# EAGLE design HIC_Board (EAGLE 7.5.0)
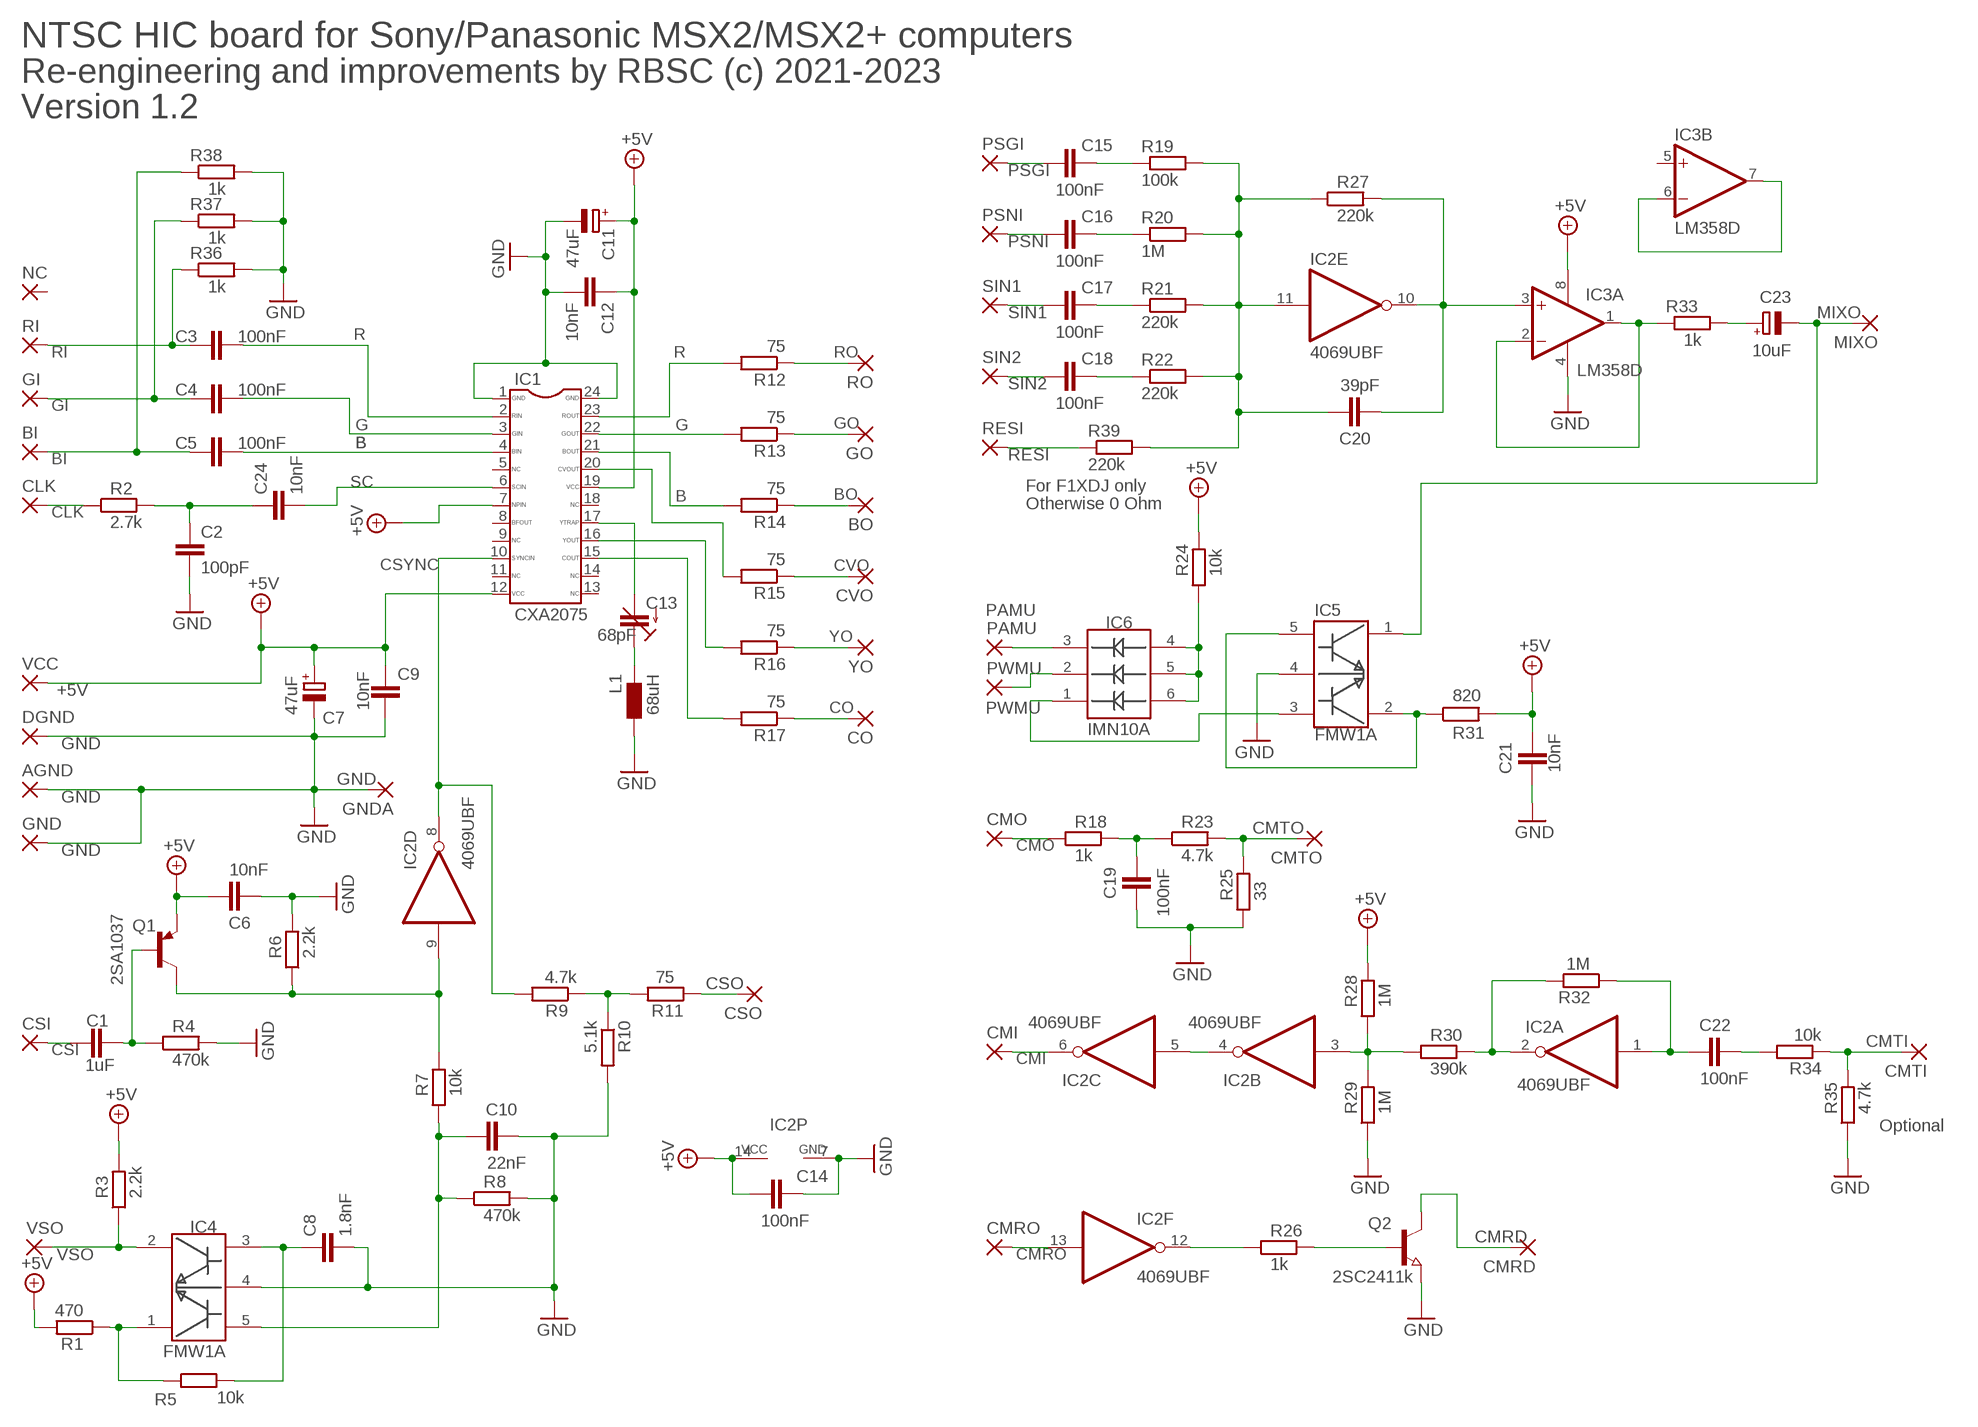
[diagram p0: schematic, sheet 1]

## Parts
AGND  HICPADSMD  [SMD1,27-2,54]
BI  HICPADSMD  [SMD1,27-2,54]
BO  HICPADSMD  [SMD1,27-2,54]
C1  1uF  C-EUC1210  [C1210]
C2  100pF  C-EUC0805  [C0805]
C3  100nF  C-EUC0805  [C0805]
C4  100nF  C-EUC0805  [C0805]
C5  100nF  C-EUC0805  [C0805]
C6  10nF  C-EUC0805  [C0805]
C7  47uF  CPOL-EUSMCB  [SMC_B]
C8  1.8nF  C-EUC0805  [C0805]
C9  10nF  C-EUC0805  [C0805]
C10  22nF  C-EUC0805  [C0805]
C11  47uF  CPOL-EUSMCB  [SMC_B]
C12  10nF  C-EUC0805  [C0805]
C13  68pF  C-TRIMMTZ03  [CTRIMTZ03]
C14  100nF  C-EUC0805  [C0805]
C15  100nF  C-EUC0805  [C0805]
C16  100nF  C-EUC0805  [C0805]
C17  100nF  C-EUC0805  [C0805]
C18  100nF  C-EUC0805  [C0805]
C19  100nF  C-EUC0805  [C0805]
C20  39pF  C-EUC0805  [C0805]
C21  10nF  C-EUC0805  [C0805]
C22  100nF  C-EUC0805  [C0805]
C23  10uF  CPOL-EUSMCB  [SMC_B]
C24  10nF  C-EUC0805  [C0805]
CLK  HICPADSMD  [SMD1,27-2,54]
CMI  HICPADSMD  [SMD1,27-2,54]
CMO  HICPADSMD  [SMD1,27-2,54]
CMRD  HICPADSMD  [SMD1,27-2,54]
CMRO  HICPADSMD  [SMD1,27-2,54]
CMTI  HICPADSMD  [SMD1,27-2,54]
CMTO  HICPADSMD  [SMD1,27-2,54]
CO  HICPADSMD  [SMD1,27-2,54]
CSI  HICPADSMD  [SMD1,27-2,54]
CSO  HICPADSMD  [SMD1,27-2,54]
CVO  HICPADSMD  [SMD1,27-2,54]
DGND  HICPADSMD  [SMD1,27-2,54]
GI  HICPADSMD  [SMD1,27-2,54]
GND  HICPADSMD  [SMD1,27-2,54]
GNDA  HICPADSMD  [SMD1,27-2,54]
GO  HICPADSMD  [SMD1,27-2,54]
IC1  CXA2075  [SOP24]
IC2  4069UBF  74HCT04D  [SO14]
IC3  LM358D  [SO08]
IC4  FMW1A  [SMT5]
IC5  FMW1A  [SMT5]
IC6  IMN10A  [SMT6]
L1  68uH  LL3225M  [L3225M]
MIXO  HICPADSMD  [SMD1,27-2,54]
NC  HICPADSMD  [SMD1,27-2,54]
PAMU  HICPADSMD  [SMD1,27-2,54]
PSGI  HICPADSMD  [SMD1,27-2,54]
PSNI  HICPADSMD  [SMD1,27-2,54]
PWMU  HICPADSMD  [SMD1,27-2,54]
Q1  2SA1037  BCX71SMD  [SOT23]
Q2  2SC2411k  NPN-TRANSISTOR_SOT23  [SOT23]
R1  470  R-EU_R0805  [R0805]
R2  2.7k  R-EU_R0805  [R0805]
R3  2.2k  R-EU_R0805  [R0805]
R4  470k  R-EU_R0805  [R0805]
R5  10k  R-EU_R0805  [R0805]
R6  2.2k  R-EU_R0805  [R0805]
R7  10k  R-EU_R0805  [R0805]
R8  470k  R-EU_R0805  [R0805]
R9  4.7k  R-EU_R0805  [R0805]
R10  5.1k  R-EU_R0805  [R0805]
R11  75  R-EU_R0805  [R0805]
R12  75  R-EU_R0805  [R0805]
R13  75  R-EU_R0805  [R0805]
R14  75  R-EU_R0805  [R0805]
R15  75  R-EU_R0805  [R0805]
R16  75  R-EU_R0805  [R0805]
R17  75  R-EU_R0805  [R0805]
R18  1k  R-EU_R0805  [R0805]
R19  100k  R-EU_R0805  [R0805]
R20  1M  R-EU_R0805  [R0805]
R21  220k  R-EU_R0805  [R0805]
R22  220k  R-EU_R0805  [R0805]
R23  4.7k  R-EU_R0805  [R0805]
R24  10k  R-EU_R0805  [R0805]
R25  33  R-EU_R0805  [R0805]
R26  1k  R-EU_R0805  [R0805]
R27  220k  R-EU_R0805  [R0805]
R28  1M  R-EU_R0805  [R0805]
R29  1M  R-EU_R0805  [R0805]
R30  390k  R-EU_R0805  [R0805]
R31  820  R-EU_R0805  [R0805]
R32  1M  R-EU_R0805  [R0805]
R33  1k  R-EU_R0805  [R0805]
R34  10k  R-EU_R0805  [R0805]
R35  4.7k  R-EU_R0805  [R0805]
R36  1k  R-EU_R0805  [R0805]
R37  1k  R-EU_R0805  [R0805]
R38  1k  R-EU_R0805  [R0805]
R39  220k  R-EU_R0805  [R0805]
RESI  HICPADSMD  [SMD1,27-2,54]
RI  HICPADSMD  [SMD1,27-2,54]
RO  HICPADSMD  [SMD1,27-2,54]
SIN1  HICPADSMD  [SMD1,27-2,54]
SIN2  HICPADSMD  [SMD1,27-2,54]
VCC  HICPADSMD  [SMD1,27-2,54]
VSO  HICPADSMD  [SMD1,27-2,54]
YO  HICPADSMD  [SMD1,27-2,54]

## Nets
+5V: C6.1 C7.+ C9.2 C11.+ C12.1 C14.2 C21.2 IC1.7 IC1.12 IC1.19 IC2.14(P:VCC) IC3.8(P:V+) Q1.2(E) R1.2 R3.2 R24.2 R28.2 R31.2 VCC.1(P)
CMRD: CMRD.1(P) Q2.3(C)
CMTI: CMTI.1(P) R34.1 R35.2
CMTO: CMTO.1(P) R23.2 R25.2
CSO: CSO.1(P) R11.1
GND: AGND.1(P) C2.1 C6.2 C7.- C8.1 C9.1 C10.2 C11.- C12.2 C14.1 C19.2 C21.1 DGND.1(P) GND.1(P) GNDA.1(P) IC1.1 IC1.24 IC2.7(P:GND) IC3.4(P:V-) IC4.4 IC5.4 L1.1 Q2.2(E) R4.2 R6.2 R8.2 R10.2 R25.1 R29.1 R35.1 R36.2 R37.2 R38.2
MIXO: C23.- IC5.1 MIXO.1(P)
N$1: IC1.23 R12.2
N$2: IC1.22 R13.2
N$3: IC1.21 R14.2
N$4: R12.1 RO.1(P)
N$5: GO.1(P) R13.1
N$6: C3.1 R36.1 RI.1(P)
N$7: C4.1 GI.1(P) R37.1
N$8: BO.1(P) R14.1
N$9: R16.1 YO.1(P)
N$10: CVO.1(P) R15.1
N$11: C2.2 C24.2 R2.2
N$12: R39.1 RESI.1(P)
N$13: C1.2 CSI.1(P)
N$14: CLK.1(P) R2.1
N$15: C13.1(E) L1.2
N$16: IC1.16 R16.2
N$17: CMO.1(P) R18.1
N$19: CMI.1(P) IC2.6(C:O)
N$21: C19.1 R18.2 R23.1
N$22: IC2.4(B:O) IC2.5(C:I)
N$24: C13.2(A) IC1.17
N$25: IC2.3(B:I) R28.1 R29.2 R30.1
N$26: CMRO.1(P) IC2.13(F:I)
N$27: IC2.2(A:O) R30.2 R32.2
N$28: C22.1 IC2.1(A:I) R32.1
N$29: C22.2 R34.2
N$31: IC2.12(F:O) R26.1
N$32: Q2.1(B) R26.2
N$38: C17.2 R21.1
N$39: C15.2 R19.1
N$40: C16.2 R20.1
N$41: C18.2 R22.1
N$43: C20.2 IC2.10(E:O) IC3.3(A:+IN) R27.2
N$44: C23.+ R33.2
N$46: IC3.6(B:-IN) IC3.7(B:OUT)
N$47: IC5.2 IC5.5 R31.1
N$48: IC5.3 IC6.1
N$49: IC6.4 IC6.5 IC6.6 R24.1
N$51: C1.1 Q1.1(B) R4.1
N$52: IC3.1(A:OUT) IC3.2(A:-IN) R33.1
N$53: IC2.9(D:I) Q1.3(C) R6.1 R7.2
N$54: C8.2 IC4.3 R5.2
N$55: BI.1(P) C5.1 R38.1
N$56: C4.2 IC1.3
N$57: C3.2 IC1.2
N$58: C5.2 IC1.4
N$59: IC1.10 IC2.8(D:O) R9.2
N$60: IC4.1 R1.1 R5.1
N$61: R9.1 R10.1 R11.2
N$62: C10.1 IC4.5 R7.1 R8.1
N$63: C24.1 IC1.6
N$64: IC1.20 R15.2
N$65: CO.1(P) R17.1
N$68: IC1.15 R17.2
PAMU: IC6.3 PAMU.1(P)
PSGI: C15.1 PSGI.1(P)
PSNI: C16.1 PSNI.1(P)
PWMU: IC6.2 PWMU.1(P)
RESI: C20.1 IC2.11(E:I) R19.2 R20.2 R21.2 R22.2 R27.1 R39.2
SIN1: C17.1 SIN1.1(P)
SIN2: C18.1 SIN2.1(P)
VSO: IC4.2 R3.1 VSO.1(P)
Unconnected: IC1.5 IC1.8 IC1.9 IC1.11 IC1.13 IC1.14 IC1.18 IC3.5(B:+IN) NC.1(P)

## Notes on the sheet
- NTSC HIC board for Sony/Panasonic MSX2/MSX2+ computers
- Re-engineering and improvements by RBSC (c) 2021-2023
- Version 1.2
- R
- RI | R | RO
- GI
- G | G | GO
- B | B
- BI
- SC | For F1XDJ only
- B | BO
- Otherwise 0 Ohm
- CLK
- CSYNC
- CVO
- YO
- CO
- CMO
- CSI
- CMI
- Optional
- CMRO

## Library data of the parts
AGND BI BO CLK CMI CMO CMRD CMRO CMTI CMTO CO CSI CSO CVO DGND GI GND GNDA GO MIXO NC PAMU PSGI PSNI PWMU RESI RI RO SIN1 SIN2 VCC VSO YO = combopad:HICPADSMD: SMD PAD
C1-C6 C8-C10 C12 C14-C22 C24 = rcl:C-EU: CAPACITOR, European symbol; OC_FARNELL: unknown
C7 C11 C23 = rcl:CPOL-EU: POLARIZED CAPACITOR, European symbol; OC_FARNELL: unknown
C13 = rcl:C-TRIMM: Trimm capacitor
IC1 = CXA2075M:CXA2075; OC_FARNELL: unknown
IC2 = 74xx-eu:74*04: Hex INVERTER
IC3 = linear:LM358: OP AMP also LM158; LM258; LM2904 Source: http://cache.national.com/ds/LM/LM158.pdf
IC4 IC5 = fmw1:FMW1: FMW1
IC6 = imn10:IMN10: IMN10
L1 = eagle-ltspice:L: INDUCTOR, European symbol; SPICEMODEL: NONE; SPICEPREFIX: L
Q1 = transistor-pnp:BCX71SMD: PNP Transistor
Q2 = semicon-smd-ipc:NPN-TRANSISTOR_: NPN TRANSISTOR
R1-R39 = rcl:R-EU_: RESISTOR, European symbol; OC_FARNELL: unknown

## Board
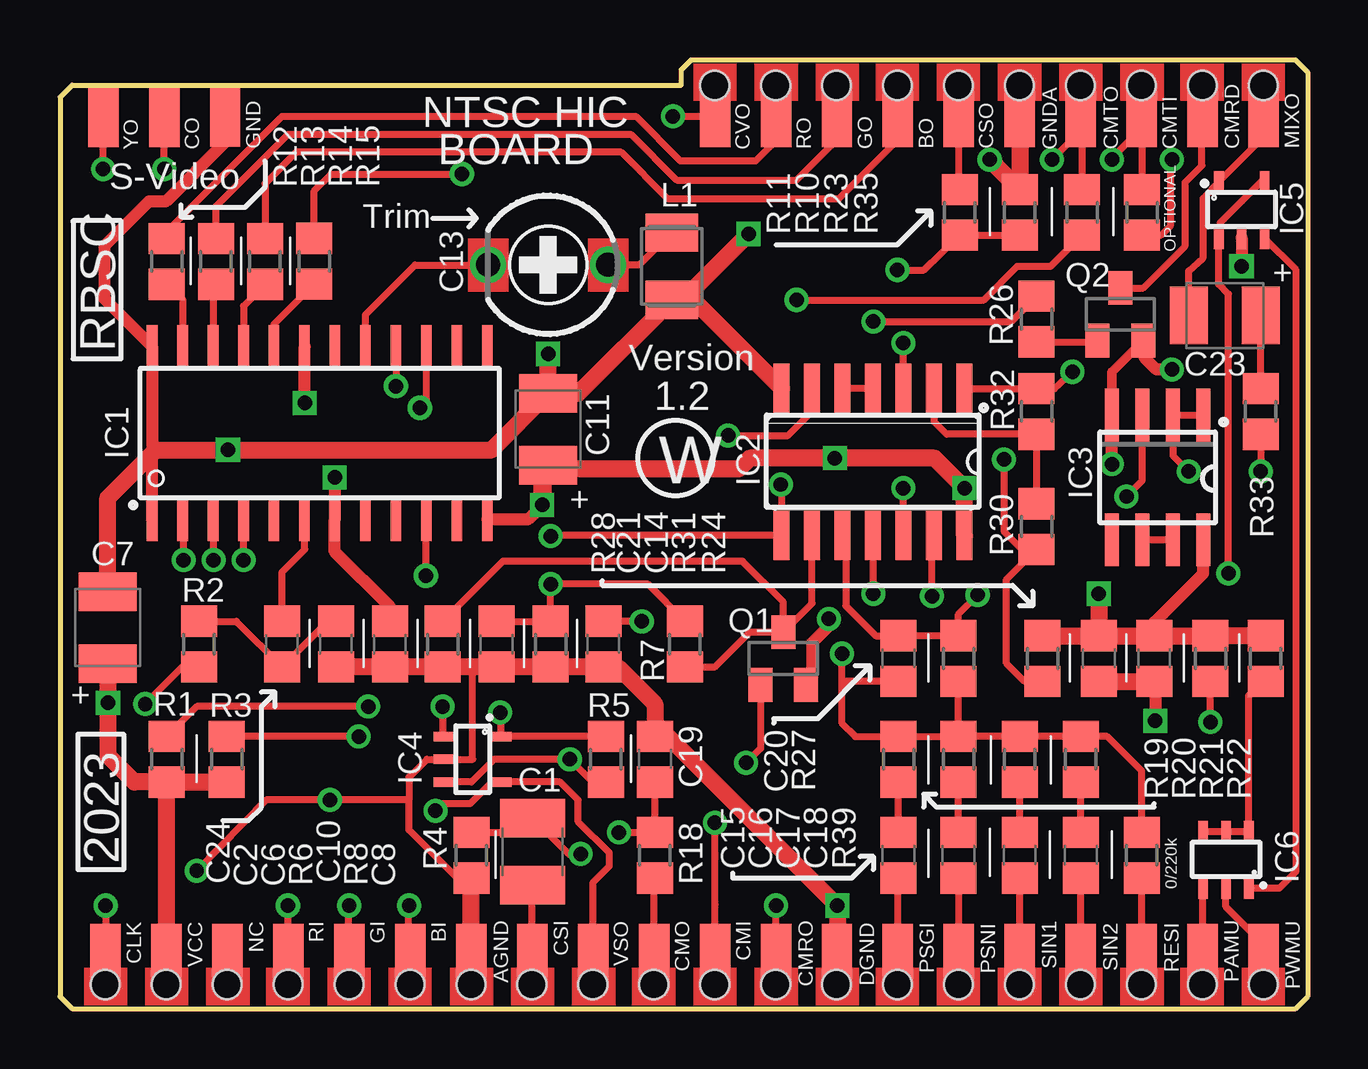
[diagram p1: board, top side]
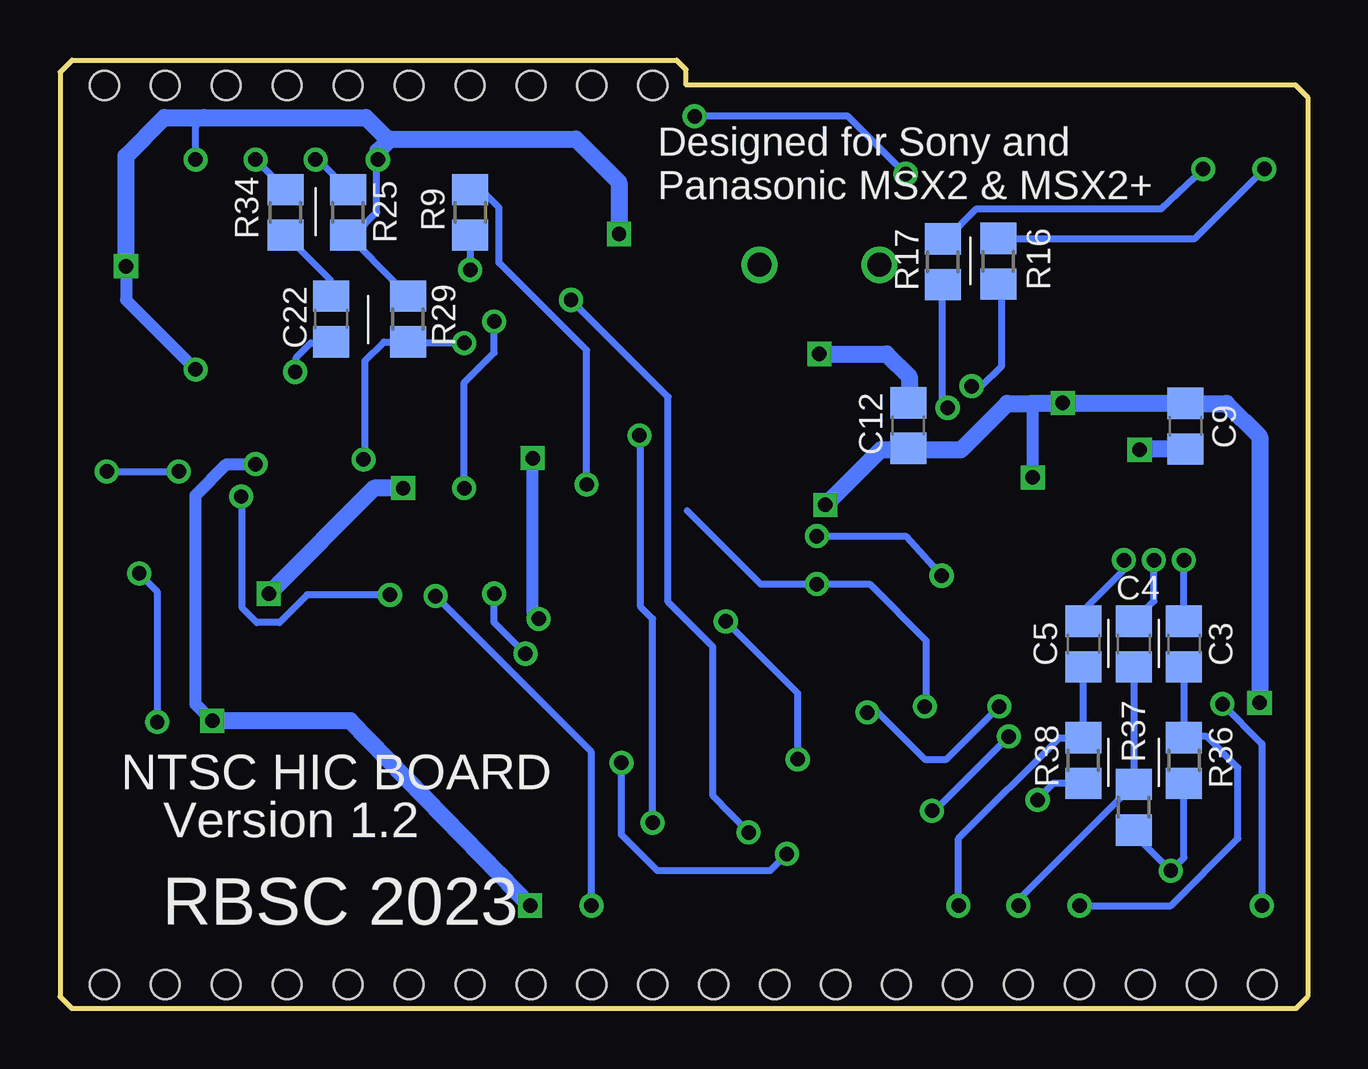
[diagram p2: board, bottom side, seen from below]

Size 52 x 39.55 mm. Coordinates in mm from the lower left corner, seen from the top.
Outline: 0,38 0,0.5 0.5,0 51.5,0 52,0.5 52,39.05 51.5,39.55 26.3,39.55 25.9,39.15 25.9,38.5 0.5,38.5 0,38
Copper layers (1*16): Top 0.035mm / dielectric 1.5mm / Bottom 0.035mm
Design rules "default *": minimum track width 10mil, minimum drill 24mil, track to track 8mil, track to pad 8mil, pad to pad 8mil, via to via 8mil, smd to smd 8mil, copper to edge 4mil, drill to drill 8mil, minimum pad ring 10mil, minimum via ring 8mil, stop-mask expansion 4mil, vias tented up to drill 24mil, thermal gap 10mil
Holes 1.2 mm at 27.29,38.49 29.83,38.49 32.37,38.49 34.91,38.49 37.45,38.49 39.99,38.49 42.53,38.49 45.07,38.49 47.61,38.49 50.15,38.49 1.89,1.01 4.43,1.01 6.97,1.01 9.51,1.01 12.05,1.01 14.59,1.01 17.13,1.01 19.67,1.01 22.21,1.01 24.75,1.01 27.29,1.01 29.83,1.01 32.37,1.01 34.91,1.01 37.45,1.01 39.99,1.01 42.53,1.01 45.07,1.01 47.61,1.01 50.15,1.01

### Footprints (pad centres in the part's own frame; a part is rotated, then mirrored left to right if it is on the bottom)
SMD1,27-2,54 = smd 1.27 x 2.54: 1 0,0
C1210 = smd 1.6 x 2.7: 1 -1.4,0; 2 1.4,0
C0805 = smd 1.3 x 1.5: 1 -0.95,0; 2 0.95,0
SMC_B = smd 1.6 x 2.4: + -1.5,0; - 1.5,0
CTRIMTZ03 = drill 1: 1 0,2.5; 2 0,-2.5
SOP24 = smd 0.45 x 1.8: 1 -6.97,-3.6; 2 -5.7,-3.6; 3 -4.43,-3.6; 4 -3.16,-3.6; 5 -1.89,-3.6; 6 -0.62,-3.6; 7 0.65,-3.6; 8 1.92,-3.6; 9 3.19,-3.6; 10 4.46,-3.6; 11 5.73,-3.6; 12 7,-3.6; 13 7,3.6; 14 5.73,3.6; 15 4.46,3.6; 16 3.19,3.6; 17 1.92,3.6; 18 0.65,3.6; 19 -0.62,3.6; 20 -1.89,3.6; 21 -3.16,3.6; 22 -4.43,3.6; 23 -5.7,3.6; 24 -6.97,3.6
SO14 = smd 0.66 x 2.032: 1 -3.81,-3.073; 2 -2.54,-3.073; 3 -1.27,-3.073; 4 0,-3.073; 5 1.27,-3.073; 6 2.54,-3.073; 7 3.81,-3.073; 8 3.81,3.073; 9 2.54,3.073; 10 1.27,3.073; 11 0,3.073; 12 -1.27,3.073; 13 -2.54,3.073; 14 -3.81,3.073
SO08 = smd 0.6 x 2.2: 1 -1.905,-2.6; 2 -0.635,-2.6; 3 0.635,-2.6; 4 1.905,-2.6; 5 1.905,2.6; 6 0.635,2.6; 7 -0.635,2.6; 8 -1.905,2.6
SMT5 = smd 0.9 x 0.4: 1 1.175,0.95; 2 1.175,-0.95; 3 -1.175,-0.95; 4 -1.175,0; 5 -1.175,0.95
SMT6 = smd 0.9 x 0.4: 1 1.175,0.95; 2 1.175,0; 3 1.175,-0.95; 4 -1.175,-0.95; 5 -1.175,0; 6 -1.175,0.95
L3225M = smd 1.6 x 2.2: 1 -1.4,0; 2 1.4,0
SOT23 = smd 1 x 1.4: 1 -0.95,-1.1; 2 0.95,-1.1; 3 0,1.1
R0805 = smd 1.3 x 1.5: 1 -0.95,0; 2 0.95,0

### Placement (x,y rotation side)
AGND  17.14,2.27 0 top
BI  14.61,2.27 0 top
BO  34.92,37.2 180 top
C1  19.7,6.55 270 top
C2  11.5,15.2 90 top
C3  5.15,15.2 90 bottom
C4  7.24,15.2 90 bottom
C5  9.34,15.2 90 bottom
C6  13.75,15.2 270 top
C7  1.99,15.89 90 top
C8  22.65,15.2 90 top
C9  5.09,24.29 90 bottom
C10  18.2,15.2 270 top
C11  20.34,24.16 90 top
C12  16.64,24.31 90 bottom
C13  20.34,31.01 270 top
C14  45.61,14.6 90 top
C15  34.95,6.4 90 top
C16  37.45,6.4 90 top
C17  40,6.4 90 top
C18  42.55,6.4 90 top
C19  24.8,10.4 90 top
C20  34.95,14.6 90 top
C21  43.3,14.6 90 top
C22  40.7,28.75 90 bottom
C23  48.55,28.9 180 top
C24  9.25,15.2 270 top
CLK  1.9,2.27 0 top
CMI  27.3,2.27 0 top
CMO  24.76,2.27 0 top
CMRD  47.62,37.2 180 top
CMRO  29.84,2.27 0 top
CMTI  45.09,37.2 180 top
CMTO  42.55,37.2 180 top
CO  4.35,37.2 180 top
CSI  19.68,2.27 0 top
CSO  37.46,37.2 180 top
CVO  27.3,37.2 180 top
DGND  32.38,2.27 0 top
GI  12.06,2.27 0 top
GND  6.89,37.2 0 top
GNDA  40,37.2 180 top
GO  32.38,37.2 180 top
IC1  10.81,24 0 top
IC2  33.89,22.79 180 top
IC3  45.75,22.15 180 top
IC4  17.2,10.4 0 top
IC5  49.25,33.3 90 top
IC6  48.6,6.2 270 top
L1  25.5,30.95 90 top
MIXO  50.16,37.2 180 top
NC  6.99,2.27 0 top
PAMU  47.62,2.27 0 top
PSGI  34.92,2.27 0 top
PSNI  37.46,2.27 0 top
PWMU  50.16,2.27 0 top
Q1  30.15,14.6 0 top
Q2  44.2,28.95 0 top
R1  4.45,10.4 270 top
R2  5.8,15.2 90 top
R3  6.95,10.4 270 top
R4  17.15,6.4 270 top
R5  22.75,10.4 270 top
R6  15.95,15.2 270 top
R7  26.05,15.2 270 top
R8  20.45,15.2 270 top
R9  34.9,33.2 90 bottom
R10  40,33.2 90 top
R11  37.5,33.2 270 top
R12  4.45,31.15 270 top
R13  6.5,31.15 270 top
R14  8.55,31.15 270 top
R15  10.6,31.16 270 top
R16  12.89,31.16 270 bottom
R17  15.21,31.14 270 bottom
R18  24.8,6.4 90 top
R19  34.95,10.4 90 top
R20  37.45,10.4 90 top
R21  40,10.4 90 top
R22  42.55,10.4 90 top
R23  42.6,33.2 90 top
R24  50.25,14.6 90 top
R25  40,33.2 90 bottom
R26  40.7,28.75 270 top
R27  37.45,14.6 90 top
R28  40.95,14.6 90 top
R29  37.5,28.75 270 bottom
R30  40.7,20.1 90 top
R31  47.95,14.6 90 top
R32  40.7,24.9 270 top
R33  50.05,24.9 90 top
R34  42.6,33.2 270 bottom
R35  45.1,33.2 90 top
R36  5.15,10.35 270 bottom
R37  7.25,8.4 270 bottom
R38  9.35,10.35 270 bottom
R39  45.09,6.4 90 top
RESI  45.09,2.27 0 top
RI  9.53,2.27 0 top
RO  29.84,37.2 180 top
SIN1  40,2.27 0 top
SIN2  42.55,2.27 0 top
VCC  4.45,2.27 0 top
VSO  22.22,2.27 0 top
YO  1.8,37.2 180 top

### Tracks (layer width: path | path; a pad name or v marks a point on that pad's centre or on a via)
+5V  (via drill 0.6)
  Top 0.3: C14.2 45.61,16.11 | IC3.8 | C11.+ 20.34,21.24 v20.1,21 | IC1.12 | C6.1 13.75,16.75 | IC1.7
  Top 0.4: 10.2,27.59 IC1.19 | v11.46,22.14 v11.45,22.15
  Top 0.5: 45.61,16.11 47.65,18.15 IC3.8 | v20.1,21 19.5,20.4 IC1.12 | v10.2,25.25 10.2,27.59 | IC1.7 v11.46,22.14 | 13.75,16.75 11.45,19.05 IC1.7 | v32.05,16.25 32.05,15.95 31.35,15.25 31.35,13.75 Q1.2
  Top 0.7: v20.1,21 20.1,22.41 C11.+ 20.5,22.5 28.3,22.5 28.75,22.95 v32.3,22.95 36.45,22.95 v37.7,21.7 IC2.14 | VCC.1 R1.2 | R1.2 R3.2 | R1.2 3.1,9.45 2,10.55 v2,12.75 C7.+ | v43.3,17.3 C21.2 | C21.2 C14.2 R31.2 R24.2 | R28.2 C21.2
  Bottom 0.4: 10.21,25.23 v10.2,25.25
  Bottom 0.5: v11.45,22.15 11.45,25.18 | v32.05,16.25 32.3,16.5 v32.3,22.95
  Bottom 0.7: 11.5,25.23 10.21,25.23 C9.2 3.38,25.23 2,23.85 v2,12.75 | 16.58,23.3 14.45,23.3 12.52,25.23 11.5,25.23 | 16.58,23.3 C12.1 | 16.58,23.3 17.8,23.3 v20.1,21 | v37.7,21.7 38.9,21.7 v43.3,17.3 | 11.5,25.23 11.45,25.18
CMRD
  Top 0.3: Q2.3 45.15,30.05 46.9,31.8 46.9,34.45 47.6,35.15 47.6,37.17 CMRD.1
CMTI  (via drill 0.6)
  Top 0.3: CMTI.1 45.1,37.18 45.1,36.7 | 45.1,36.7 R35.2 | v43.85,35.4 43.85,35.45 45.1,36.7
  Bottom 0.3: R34.1 v43.85,35.4
CMTO  (via drill 0.6)
  Top 0.3: CMTO.1 42.6,37.14 42.6,36.65 | 42.6,36.65 R23.2 | v41.35,35.4 42.6,36.65
  Bottom 0.3: v41.35,35.4 41.2,35.35 R25.2
CSO
  Top 0.3: 37.5,37.16 CSO.1 37.46,34.18 R11.1
GND  (via drill 0.6)
  Top 0.3: R4.2 16.55,5.45 14.55,7.45 14.55,8.7 | 32.4,2.28 DGND.1 | 24.4,11 C19.2 | C11.- 20.79,25.66 | v20.34,27.29 v20.35,27.3 | 45.2,27.15 45.2,27.8 Q2.2 | 17.25,14.25 17.2,14.2 17.2,10.4 IC4.4 15.3,10.4 14.55,9.65 14.55,8.7 | C14.1 45.65,13.61 | v43.85,22.7 v43.84,22.7 | R10.2 39.95,34.16 | R35.1 45.9,32.25 46.3,32.65 46.3,35.3 v46.35,35.4 | 14.55,8.7 v11.25,8.7 8.6,8.7 v5.7,5.75
  Top 0.4: IC3.4 43.84,26.54 Q2.2 | 3.84,23.26 3.9,23.2 | 3.84,23.11 3.82,23.12
  Top 0.5: IC5.4 v49.25,30.95 | v46.35,26.65 45.7,26.65 45.2,27.15 | 3.84,23.26 IC1.24 1.85,29.59 1.85,31.8 3.7,33.65 4.4,33.65 6.89,36.13 GND.1 | IC1.1 3.84,23.11 | 45.65,13.61 v45.65,12 | v43.84,22.7 IC3.4
  Top 0.7: AGND.1 R4.2 | 32.4,2.28 v32.4,4.3 25.35,11.35 C19.2 24.8,12.7 23.3,14.2 22.7,14.2 C8.1 R8.2 C10.2 17.25,14.25 R6.2 C6.2 C2.1 | v20.34,27.29 C11.- 17.98,23.3 v7,23.3 4,23.3 3.9,23.2 3.82,23.12 1.99,21.29 C7.- | 20.79,25.66 21.61,25.66 L1.1 | L1.1 26.4,29.55 IC2.7 | C21.1 C14.1 | L1.1 25.95,29.55 v28.7,32.3 | GNDA.1 R10.2 | 39.95,34.16 v38.75,35.4
  Bottom 0.3: 16.6,25.3 C12.2 | R29.1 37.5,30.15 37.9,30.15 R25.1 39.75,32.25 38.8,33.2 38.8,35.35 v38.75,35.4 | v46.35,35.4 46.35,36.8 46,37.15 | 6.97,23.33 v7,23.3 | R38.2 10.6,9.4 11.25,8.75 v11.25,8.7 | R37.2 7.25,7.3 v5.7,5.75 5.15,6.3 R36.2 | 33.6,5.64 33.65,5.59
  Bottom 0.5: v49.25,30.95 49.25,29.55 v46.35,26.65 | v45.65,12 46.35,12.7 46.35,21.4 45.05,22.7 v43.85,22.7
  Bottom 0.7: v20.35,27.3 17.55,27.3 16.6,26.35 16.6,25.3 | v32.4,4.3 33.65,5.59 39.9,12 v45.65,12 | 38.3,36.2 38.25,36.25 30.5,36.25 28.7,34.45 v28.7,32.3 28.75,32.3 | v49.25,30.95 49.25,35.55 47.65,37.15 46,37.15 39.25,37.15 38.3,36.2 | v38.75,35.4 38.75,35.75 38.3,36.2 | C9.1 6.97,23.33
MIXO
  Top 0.3: MIXO.1 50.16,36.34 IC5.1 47.65,33.77 47.65,31.3 47.05,30.75 C23.-
N$1
  Top 0.3: R12.2 5.11,29.59 IC1.23
N$2
  Top 0.3: R13.2 6.38,30.08 IC1.22
N$3
  Top 0.3: R14.2 7.65,29.3 IC1.21
N$4
  Top 0.3: R12.1 4.5,32.45 9.25,37.2 24,37.2 25.85,35.35 29,35.35 30.05,36.4 30.05,36.99 RO.1
N$5
  Top 0.3: R13.1 6.5,33.45 9.5,36.45 23.8,36.45 25.7,34.55 30.7,34.55 32.4,36.25 32.4,37.18 GO.1
N$6  (via drill 0.6)
  Top 0.3: RI.1 9.5,2.29 v9.5,4.3
  Bottom 0.3: C3.1 R36.1 5.1,11.35 4.2,11.35 2.9,10.05 2.9,7.1 5.7,4.3 v9.5,4.3
N$7  (via drill 0.6)
  Top 0.3: GI.1 12.04,2.29 v12.04,4.29 v12.05,4.3
  Bottom 0.3: C4.1 R37.1 12.05,4.55 v12.05,4.3
N$8
  Top 0.3: 34.92,37.12 BO.1 34.95,37.17 34.95,36.25 32.45,33.75 25.35,33.75 23.4,35.7 9.85,35.7 8.55,34.4 R14.1
N$9  (via drill 0.6)
  Top 0.3: v1.8,35 YO.1
  Bottom 0.3: R16.1 4.69,32.11 v1.8,35
N$10  (via drill 0.6)
  Top 0.3: R15.1 10.6,34.09 11.3,34.8 v16.75,34.8 | v25.55,37.2 CVO.1
  Bottom 0.3: v16.75,34.8 19.15,37.2 v25.55,37.2
N$11
  Top 0.3: R2.2 7.35,16.15 C24.2 11.15,16.15 C2.2
N$12
  Top 0.3: RESI.1 R39.1
N$13
  Top 0.3: CSI.1 19.68,5.14 C1.2
N$14  (via drill 0.6)
  Top 0.3: 2,2.36 CLK.1 v1.9,4.3 | R2.1 5.1,14.25 v3.55,12.7
  Bottom 0.3: v3.55,12.7 1.9,11.05 v1.9,4.3
N$15
  Top 0.3: C13.1 24.16,31.01 L1.2
N$16  (via drill 0.6)
  Top 0.3: IC1.16 v14,25.95
  Bottom 0.3: v14,25.95 13.6,25.95 12.75,26.8 12.75,30.06 R16.2
N$17
  Top 0.3: CMO.1 24.76,5.42 R18.1
N$19  (via drill 0.6)
  Top 0.3: v27.85,23.9 30.35,23.9 31.35,24.9 IC2.6 | CMI.1 27.3,4.35 v27.3,7.75
  Bottom 0.3: v27.85,23.9 27.8,23.85 27.8,16.75 27.3,16.25 v27.3,7.75
N$21  (via drill 0.6)
  Top 0.3: v30.7,29.55 38.5,29.55 39.9,30.95 41.3,30.95 R23.1 | C19.1 R18.2 v23.3,7.35
  Bottom 0.3: v30.7,29.55 26.65,25.5 26.65,16.95 24.8,15.1 24.8,8.9 v23.3,7.35
N$22
  Top 0.3: IC2.5 IC2.4
N$24
  Top 0.3: IC1.17 12.73,28.93 14.8,31 17.83,31 C13.2
N$25  (via drill 0.6)
  Top 0.3: IC2.3 v35.16,27.76 v35.15,27.75 | R28.1 40.2,13.65 39.45,14.4 39.45,17.9 R30.1 40.1,19.15 39.35,19.9 v39.35,22.9
  Bottom 0.3: v39.35,22.9 39.3,22.95 39.3,27 38.5,27.8 R29.2 37.45,27.75 v35.15,27.75
N$26  (via drill 0.6)
  Top 0.3: CMRO.1 29.84,4.07 v29.85,4.3 | 36.45,19.7 IC2.13 36.35,19.64 v36.35,17.2
  Bottom 0.3: v29.85,4.3 29.85,10.7 v36.35,17.2
N$27
  Top 0.3: IC2.2 36.45,25.85 36.45,24.45 36.95,23.95 R32.2 R30.2
N$28  (via drill 0.6)
  Top 0.3: IC2.1 37.72,25.85 R32.1 41.45,25.85 v42.2,26.55
  Bottom 0.3: v42.2,26.55 42.15,27.15 41.55,27.75 40.75,27.75 C22.1
N$29
  Bottom 0.3: C22.2 40.7,30.35 R34.2
N$31  (via drill 0.6)
  Top 0.3: IC2.12 35.15,19.73 v35.15,21.7 | v33.9,28.65 39.65,28.65 R26.1
  Bottom 0.3: v35.15,21.7 35.15,26.1 33.9,27.35 v33.9,28.65
N$32
  Top 0.3: R26.2 43.2,27.8 Q2.1
N$38
  Top 0.3: C17.2 R21.1
N$39
  Top 0.3: C15.2 R19.1
N$40
  Top 0.3: C16.2 R20.1
N$41
  Top 0.3: C18.2 R22.1
N$43  (via drill 0.6)
  Top 0.3: IC2.10 32.75,19.59 32.75,16.8 34,15.55 C20.2 R27.2 37.45,16.45 v38.25,17.25 | IC3.3 45.1,24.73 45.1,22 v44.45,21.35
  Bottom 0.3: v38.25,17.25 41.7,17.25 42.85,16.1 43.8,16.1 44.4,16.7 44.4,21.3 v44.45,21.35
N$44
  Top 0.3: R33.2 C23.+
N$46
  Top 0.3: IC3.7 IC3.6
N$47  (via drill 0.6)
  Top 0.3: v48.7,18.15 48.7,29.8 48.3,30.2 IC5.5 48.35,32.17 48.35,32.75 50.07,34.48 IC5.2 | v47.95,11.95 R31.1
  Bottom 0.3: v48.7,18.15 47.95,17.4 v47.95,11.95
N$48
  Top 0.3: IC5.3 51.5,30.82 51.5,5.7 50.82,5.03 IC6.1
N$49
  Top 0.3: IC6.6 IC6.5 | IC6.6 IC6.4 | IC6.6 49.55,13.05 R24.1
N$51  (via drill 0.6)
  Top 0.3: R4.1 19.1,7.35 C1.1 21.2,6.45 v21.7,6.45 | Q1.1 29.2,10.85 v28.6,10.25
  Bottom 0.3: v21.7,6.45 22.4,5.75 27.1,5.75 28.6,7.25 v28.6,10.25
N$52  (via drill 0.6)
  Top 0.3: IC3.1 IC3.2 46.4,24.73 46.4,23.05 v47.05,22.4 | R33.1 v50.05,22.4
  Bottom 0.3: v50.05,22.4 v47.05,22.4
N$53
  Top 0.3: Q1.3 31.35,16.9 IC2.9 | Q1.3 30.15,16.95 28.45,18.65 18.45,18.65 R6.1 | R7.2 27.3,14.25 28.75,15.7 Q1.3
N$54  (via drill 0.6)
  Top 0.3: R5.2 22.2,9.45 v21.25,10.4 18.1,10.4 17.15,9.45 IC4.3 | v24.25,16.15 C8.2
  Bottom 0.3: v21.25,10.4 21.25,13.15 v24.25,16.15
N$55  (via drill 0.6)
  Top 0.3: BI.1 14.54,2.33 v14.54,4.29 v14.55,4.3
  Bottom 0.3: C5.1 R38.1 10.35,11.3 14.55,7.1 v14.55,4.3
N$56  (via drill 0.6)
  Top 0.3: v6.4,18.7 6.4,20.38 IC1.3
  Bottom 0.3: C4.2 6.4,16.99 v6.4,18.7
N$57  (via drill 0.6)
  Top 0.3: v5.15,18.7 5.15,20.36 IC1.2
  Bottom 0.3: C3.2 v5.15,18.7
N$58  (via drill 0.6)
  Top 0.3: v7.65,18.7 IC1.4
  Bottom 0.3: C5.2 9.34,16.61 7.65,18.3 v7.65,18.7
N$59  (via drill 0.6)
  Top 0.3: v20.45,19.7 20.67,19.72 IC2.8 30.08,21.37 v30.05,21.85 | v15.25,18.05 15.25,20.38 IC1.10
  Bottom 0.3: v20.45,19.7 16.75,19.7 v15.25,18.05 | v30.05,21.85 30.05,27.45 33.7,31.1 33.7,33.4 34.45,34.15 R9.2
N$60  (via drill 0.6)
  Top 0.3: R5.1 IC4.1 18.38,12.33 v18.35,12.35 | v12.85,12.6 5.7,12.6 R1.1
  Bottom 0.3: v18.35,12.35 17.9,12.35 15.95,10.4 15.05,10.4 v12.85,12.6
N$61  (via drill 0.6)
  Top 0.3: R10.1 R11.2 36,30.8 v34.9,30.8
  Bottom 0.3: R9.1 v34.9,30.8
N$62  (via drill 0.6)
  Top 0.3: C10.1 R8.1 v20.45,17.7 24.5,17.7 R7.1 | v15.95,12.6 15.95,11.43 IC4.5
  Bottom 0.3: v20.45,17.7 18.25,17.7 15.9,15.35 15.9,12.65 v15.95,12.6 | v20.45,17.7 20.6,17.7 | 25.85,20.75 22.8,17.7 v20.45,17.7
N$63
  Top 0.3: IC1.6 10.2,19.15 9.25,18.2 C24.1
N$64
  Top 0.3: R15.2 8.92,28.54 IC1.20
N$65  (via drill 0.6)
  Top 0.3: v4.35,35 CO.1
  Bottom 0.3: R17.1 15.06,32.09 13.8,33.35 6.1,33.35 v4.35,35
N$68  (via drill 0.6)
  Top 0.3: IC1.15 15.27,25.32 v15,25.05
  Bottom 0.3: R17.2 15.25,30.14 15.25,25.3 v15,25.05
PAMU
  Top 0.3: PAMU.1 47.62,5 IC6.3
PSGI
  Top 0.3: PSGI.1 34.92,5.33 C15.1
PSNI
  Top 0.3: PSNI.1 37.46,5.33 C16.1
PWMU
  Top 0.3: PWMU.1 50.16,2.69 48.6,4.25 IC6.2
RESI  (via drill 0.6)
  Top 0.3: R20.2 R21.2 R22.2 43.65,11.35 45.09,9.92 R39.2 | R20.2 R19.2 33.15,11.35 32.6,11.9 32.6,13.45 | R20.2 R27.1 | v33.9,17.3 IC2.11 | 32.6,13.45 v32.6,14.8 | C20.1 32.8,13.65 32.6,13.45
  Bottom 0.3: v32.6,14.8 33.9,16.1 v33.9,17.3
SIN1
  Top 0.3: SIN1.1 40,5.35 C17.1
SIN2
  Top 0.3: SIN2.1 42.55,5.35 C18.1
VSO  (via drill 0.6)
  Top 0.3: v15.65,8.25 15.95,8.55 17.1,8.55 18,9.45 IC4.2 20.85,9.45 21.6,8.7 21.6,7.8 22.9,6.5 22.9,5.95 22.22,5.28 VSO.1 | v12.45,11.35 R3.1
  Bottom 0.3: v15.65,8.25 15.55,8.25 v12.45,11.35
(copper drawn outside any net)
  shapes: Top area x32

### Text on the board
tNames: NTSC HIC | BOARD | S-Video | Trim | OPTIONAL | C13 | + | RBSC | Version | 1.2 | W | + | + | 2023 | 0/220k
bNames: Designed for Sony and / Panasonic MSX2 & MSX2+ | NTSC HIC BOARD | Version 1.2 | RBSC 2023